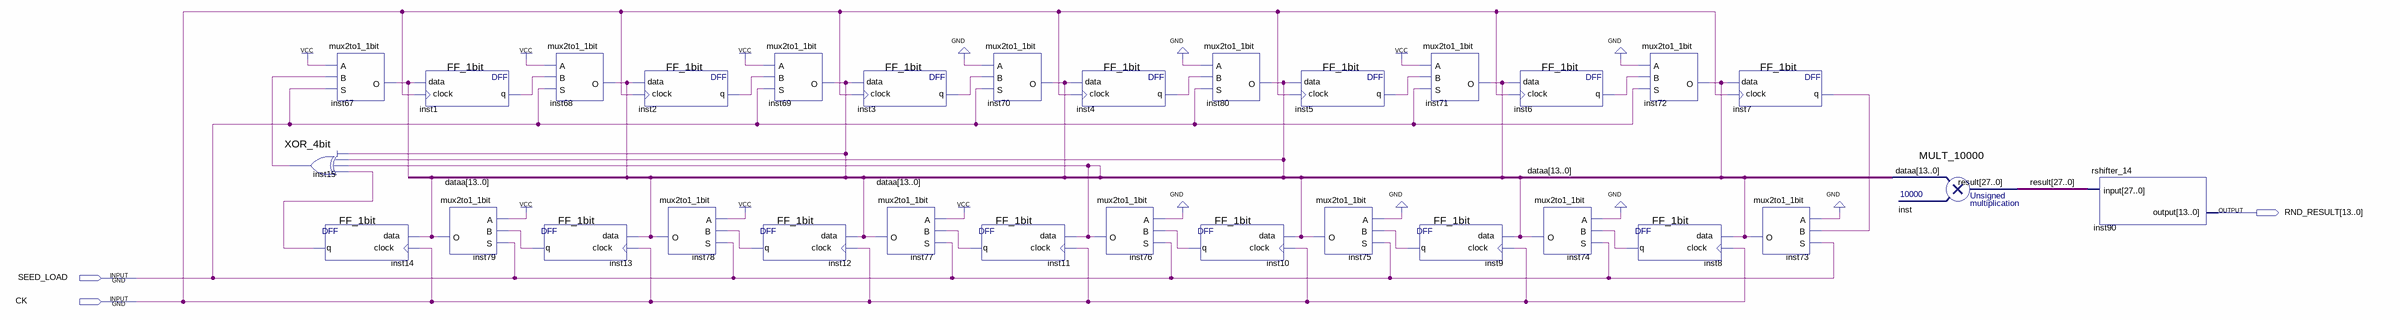
[diagram p0: schematic sheet]
// Quartus schematic random_10000.bdf as structural Verilog: 31 symbols, 3 pins
module random_10000 (
  input  SEED_LOAD,
  input  CK,
  output [13:0] RND_RESULT
);

  wire inst1_q, inst2_q, inst3_q, inst4_q, inst5_q, inst6_q, inst7_q, inst8_q, inst9_q, inst10_q, inst11_q,
       inst12_q, inst13_q, inst14_q, inst15_result;
  wire [13:0] dataa;
  wire [27:0] result;

  mux2to1_1bit inst67 (.A(1'b1), .B(inst15_result), .S(SEED_LOAD), .O(dataa[0]));
  XOR_4bit inst15 (.data0(dataa[2]), .data1(dataa[4]), .data2(dataa[10]), .data3(inst14_q), .result(inst15_result));
  FF_1bit inst14 (.data(dataa[13]), .clock(CK), .q(inst14_q));
  FF_1bit inst1 (.data(dataa[0]), .clock(CK), .q(inst1_q));
  mux2to1_1bit inst79 (.A(1'b1), .B(inst13_q), .S(SEED_LOAD), .O(dataa[13]));
  mux2to1_1bit inst68 (.A(1'b1), .B(inst1_q), .S(SEED_LOAD), .O(dataa[1]));
  FF_1bit inst13 (.data(dataa[12]), .clock(CK), .q(inst13_q));
  FF_1bit inst2 (.data(dataa[1]), .clock(CK), .q(inst2_q));
  mux2to1_1bit inst78 (.A(1'b1), .B(inst12_q), .S(SEED_LOAD), .O(dataa[12]));
  FF_1bit inst12 (.data(dataa[11]), .clock(CK), .q(inst12_q));
  mux2to1_1bit inst69 (.A(1'b1), .B(inst2_q), .S(SEED_LOAD), .O(dataa[2]));
  FF_1bit inst3 (.data(dataa[2]), .clock(CK), .q(inst3_q));
  mux2to1_1bit inst77 (.A(1'b1), .B(inst11_q), .S(SEED_LOAD), .O(dataa[11]));
  mux2to1_1bit inst70 (.A(1'b0), .B(inst3_q), .S(SEED_LOAD), .O(dataa[3]));
  FF_1bit inst11 (.data(dataa[10]), .clock(CK), .q(inst11_q));
  FF_1bit inst4 (.data(dataa[3]), .clock(CK), .q(inst4_q));
  mux2to1_1bit inst76 (.A(1'b0), .B(inst10_q), .S(SEED_LOAD), .O(dataa[10]));
  mux2to1_1bit inst80 (.A(1'b0), .B(inst4_q), .S(SEED_LOAD), .O(dataa[4]));
  FF_1bit inst10 (.data(dataa[9]), .clock(CK), .q(inst10_q));
  FF_1bit inst5 (.data(dataa[4]), .clock(CK), .q(inst5_q));
  mux2to1_1bit inst75 (.A(1'b0), .B(inst9_q), .S(SEED_LOAD), .O(dataa[9]));
  FF_1bit inst9 (.data(dataa[8]), .clock(CK), .q(inst9_q));
  mux2to1_1bit inst71 (.A(1'b1), .B(inst5_q), .S(SEED_LOAD), .O(dataa[5]));
  FF_1bit inst6 (.data(dataa[5]), .clock(CK), .q(inst6_q));
  mux2to1_1bit inst74 (.A(1'b0), .B(inst8_q), .S(SEED_LOAD), .O(dataa[8]));
  mux2to1_1bit inst72 (.A(1'b0), .B(inst6_q), .S(SEED_LOAD), .O(dataa[6]));
  FF_1bit inst8 (.data(dataa[7]), .clock(CK), .q(inst8_q));
  FF_1bit inst7 (.data(dataa[6]), .clock(CK), .q(inst7_q));
  mux2to1_1bit inst73 (.A(1'b0), .B(inst7_q), .S(SEED_LOAD), .O(dataa[7]));
  MULT_10000 inst (.dataa(dataa), .result(result));
  rshifter_14 inst90 (.\input (result), .\output (RND_RESULT));
endmodule
